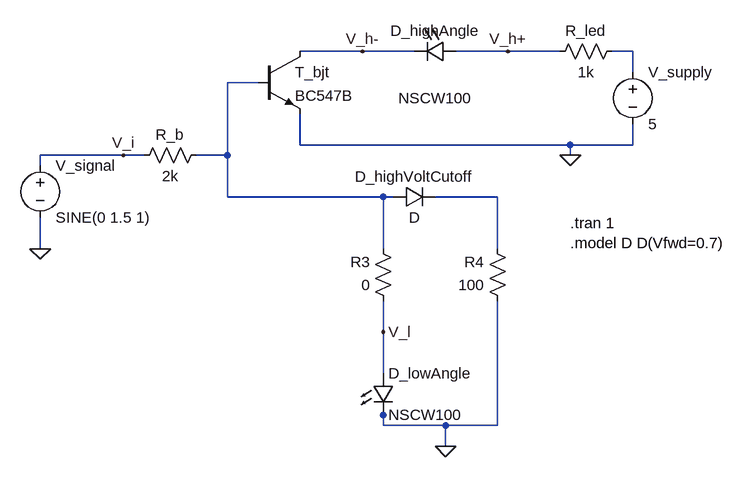
[diagram p0: schematic LEDUI_1.asc]
LEDUI_1.asc, the LTspice schematic file:
Version 4
SHEET 1 960 944
WIRE 128 320 32 320
WIRE 208 320 128 320
WIRE 352 320 272 320
WIRE 432 320 352 320
WIRE 544 320 512 320
WIRE 544 352 544 320
WIRE -32 368 -80 368
WIRE 32 464 32 416
WIRE 448 464 32 464
WIRE 544 464 544 432
WIRE 544 464 448 464
WIRE -240 480 -368 480
WIRE -208 480 -240 480
WIRE -80 480 -80 368
WIRE -80 480 -128 480
WIRE 448 480 448 464
WIRE -368 496 -368 480
WIRE -80 544 -80 480
WIRE 160 544 -80 544
WIRE 176 544 160 544
WIRE 336 544 240 544
WIRE -368 624 -368 576
WIRE 160 624 160 544
WIRE 336 624 336 544
WIRE 160 752 160 704
WIRE 160 816 160 752
WIRE 160 880 160 864
WIRE 160 896 160 880
WIRE 256 896 160 896
WIRE 336 896 336 704
WIRE 336 896 256 896
WIRE 256 928 256 896
FLAG 448 480 0
FLAG 256 928 0
FLAG -368 624 0
FLAG -240 480 V_i
FLAG 160 752 V_l
FLAG 352 320 V_h+
FLAG 128 320 V_h-
SYMBOL voltage -368 480 R0
SYMATTR InstName V_signal
SYMATTR Value SINE(0 1.5 1)
SYMBOL voltage 544 336 R0
SYMATTR InstName V_supply
SYMATTR Value 5
SYMBOL diode 176 560 R270
WINDOW 0 32 32 VTop 2
WINDOW 3 0 32 VBottom 2
SYMATTR InstName D_highVoltCutoff
SYMBOL LED 272 304 R90
WINDOW 0 0 32 VBottom 2
WINDOW 3 72 32 VTop 2
SYMATTR InstName D_highAngle
SYMATTR Value NSCW100
SYMBOL res 528 304 R90
WINDOW 0 0 56 VBottom 2
WINDOW 3 32 56 VTop 2
SYMATTR InstName R_led
SYMATTR Value 1k
SYMBOL res -112 464 R90
WINDOW 0 0 56 VBottom 2
WINDOW 3 32 56 VTop 2
SYMATTR InstName R_b
SYMATTR Value 2k
SYMBOL res 176 720 R180
WINDOW 0 36 76 Left 2
WINDOW 3 36 40 Left 2
SYMATTR InstName R3
SYMATTR Value 0
SYMBOL res 352 720 R180
WINDOW 0 36 76 Left 2
WINDOW 3 36 40 Left 2
SYMATTR InstName R4
SYMATTR Value 100
SYMBOL npn -32 320 R0
SYMATTR InstName T_bjt
SYMATTR Value BC547B
SYMBOL LED 144 816 R0
SYMATTR InstName D_lowAngle
SYMATTR Value NSCW100
TEXT 448 584 Left 2 !.tran 1\n.model D D(Vfwd=0.7)

The netlist it stands for:
* LEDUI_1.asc
V_signal V_i 0 SINE(0 1.5 1)
V_supply N001 0 5
D_highVoltCutoff N002 N003 D
D_highAngle V_h+ V_h- NSCW100
R_led N001 V_h+ 1k
R_b N002 V_i 2k
R3 V_l N002 0
R4 0 N003 100
Q§T_bjt V_h- N002 0 0 BC547B
D_lowAngle V_l 0 NSCW100
.model D D
.lib standard.dio
.model NPN NPN
.model PNP PNP
.lib standard.bjt
.tran 1
.model D D(Vfwd=0.7)
.backanno
.end